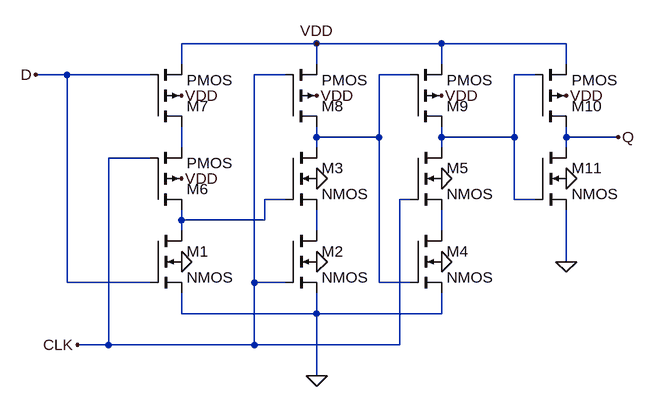
[diagram p0: schematic DFF.asc]
DFF.asc, the LTspice schematic file:
Version 4
SHEET 1 880 680
WIRE 32 -128 -176 -128
WIRE 224 -128 32 -128
WIRE 416 -128 224 -128
WIRE -176 -96 -176 -128
WIRE 32 -96 32 -128
WIRE 224 -96 224 -128
WIRE 416 -96 416 -128
WIRE -352 -80 -400 -80
WIRE -224 -80 -352 -80
WIRE -16 -80 -64 -80
WIRE 176 -80 128 -80
WIRE 368 -80 336 -80
WIRE 32 16 32 0
WIRE 128 16 128 -80
WIRE 128 16 32 16
WIRE 224 16 224 0
WIRE 336 16 336 -80
WIRE 336 16 224 16
WIRE 416 16 416 0
WIRE 496 16 416 16
WIRE -176 32 -176 0
WIRE 32 32 32 16
WIRE 224 32 224 16
WIRE 416 32 416 16
WIRE -224 48 -288 48
WIRE -16 112 -48 112
WIRE 176 112 160 112
WIRE 336 112 336 16
WIRE 368 112 336 112
WIRE -176 144 -176 128
WIRE -48 144 -48 112
WIRE -48 144 -176 144
WIRE -176 160 -176 144
WIRE 32 160 32 128
WIRE 224 160 224 128
WIRE 416 208 416 128
WIRE -352 240 -352 -80
WIRE -224 240 -352 240
WIRE -64 240 -64 -80
WIRE -16 240 -64 240
WIRE 128 240 128 16
WIRE 176 240 128 240
WIRE -176 288 -176 256
WIRE 32 288 32 256
WIRE 32 288 -176 288
WIRE 224 288 224 256
WIRE 224 288 32 288
WIRE -288 336 -288 48
WIRE -288 336 -336 336
WIRE -64 336 -64 240
WIRE -64 336 -288 336
WIRE 160 336 160 112
WIRE 160 336 -64 336
WIRE 32 384 32 288
FLAG 32 -128 VDD
FLAG -336 336 CLK
FLAG 32 384 0
FLAG 416 208 0
FLAG -400 -80 D
FLAG 496 16 Q
FLAG -176 208 0
FLAG 32 208 0
FLAG 224 208 0
FLAG 32 80 0
FLAG 224 80 0
FLAG 416 80 0
FLAG -176 -48 VDD
FLAG 32 -48 VDD
FLAG 224 -48 VDD
FLAG 416 -48 VDD
FLAG -176 80 VDD
SYMBOL nmos4 -224 160 R0
SYMATTR InstName M1
SYMBOL nmos4 -16 160 R0
SYMATTR InstName M2
SYMBOL nmos4 -16 32 R0
SYMATTR InstName M3
SYMBOL nmos4 176 160 R0
SYMATTR InstName M4
SYMBOL nmos4 176 32 R0
SYMATTR InstName M5
SYMBOL pmos4 -224 128 M180
SYMATTR InstName M6
SYMBOL pmos4 -224 0 M180
SYMATTR InstName M7
SYMBOL pmos4 -16 0 M180
SYMATTR InstName M8
SYMBOL pmos4 176 0 M180
SYMATTR InstName M9
SYMBOL pmos4 368 0 M180
SYMATTR InstName M10
SYMBOL nmos4 368 32 R0
SYMATTR InstName M11

The netlist it stands for:
* DFF.asc
M1 N004 D 0 0 NMOS
M2 N005 CLK 0 0 NMOS
M3 N001 N004 N005 0 NMOS
M4 N006 N001 0 0 NMOS
M5 N002 CLK N006 0 NMOS
M6 N004 CLK N003 VDD PMOS
M7 N003 D VDD VDD PMOS
M8 N001 CLK VDD VDD PMOS
M9 N002 N001 VDD VDD PMOS
M10 Q N002 VDD VDD PMOS
M11 Q N002 0 0 NMOS
.model NMOS NMOS
.model PMOS PMOS
.lib standard.mos
.backanno
.end